# EAGLE design grbl-cnc3ax-nano (EAGLE 7.2.0)
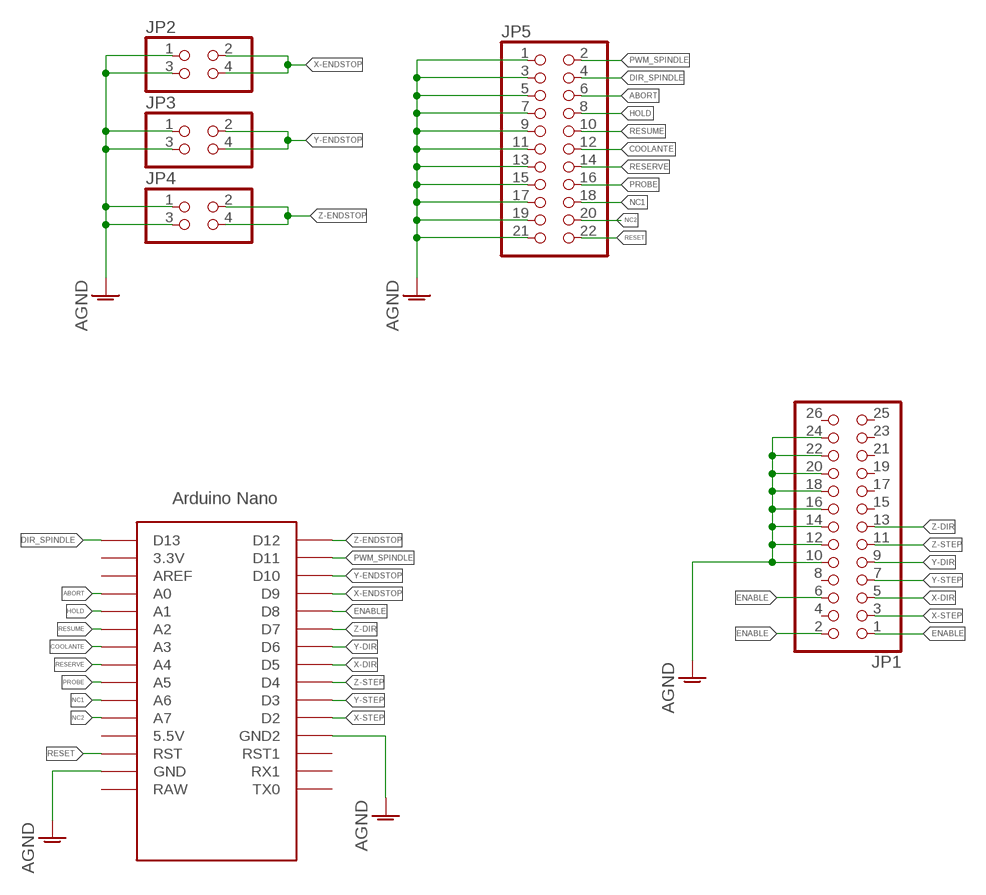
[diagram p0: schematic, sheet 1]

## Parts
JP1  PINHD-2X13  [2X13]
JP2  PINHD-2X2  [2X02]
JP3  PINHD-2X2  [2X02]
JP4  PINHD-2X2  [2X02]
JP5  PINHD-2X11  [2X11]
U$1  NANO  [NANO]

## Nets
ABORT: JP5.6 U$1.A0
AGND: JP1.10 JP1.12 JP1.14 JP1.16 JP1.18 JP1.20 JP1.22 JP1.24 JP2.1 JP2.3 JP3.1 JP3.3 JP4.1 JP4.3 JP5.1 JP5.3 JP5.5 JP5.7 JP5.9 JP5.11 JP5.13 JP5.15 JP5.17 JP5.19 JP5.21 U$1.GND U$1.GND1(GND2)
COOLANTE: JP5.12 U$1.A3
DIR_SPINDLE: JP5.4 U$1.D13
ENABLE: JP1.1 JP1.2 JP1.6 U$1.D8
HOLD: JP5.8 U$1.A1
NC1: JP5.18 U$1.A6
NC2: JP5.20 U$1.A7
PROBE: JP5.16 U$1.A5
PWM_SPINDLE: JP5.2 U$1.D11
RESERVE: JP5.14 U$1.A4
RESET: JP5.22 U$1.RST
RESUME: JP5.10 U$1.A2
X-DIR: JP1.5 U$1.D5
X-ENDSTOP: JP2.2 JP2.4 U$1.D9
X-STEP: JP1.3 U$1.D2
Y-DIR: JP1.9 U$1.D6
Y-ENDSTOP: JP3.2 JP3.4 U$1.D10
Y-STEP: JP1.7 U$1.D3
Z-DIR: JP1.13 U$1.D7
Z-ENDSTOP: JP4.2 JP4.4 U$1.D12
Z-STEP: JP1.11 U$1.D4
Unconnected: JP1.4 JP1.8 JP1.15 JP1.17 JP1.19 JP1.21 JP1.23 JP1.25 JP1.26 U$1.3.3V U$1.5V(5.5V) U$1.AREF U$1.ICSP1 U$1.ICSP2 U$1.ICSP3 U$1.ICSP4 U$1.ICSP5 U$1.ICSP6 U$1.RAW U$1.RST1 U$1.RX1 U$1.TX0

## Library data of the parts
JP1 = pinhead:PINHD-2X13: PIN HEADER
JP2-JP4 = pinhead:PINHD-2X2: PIN HEADER
JP5 = pinhead:PINHD-2X11: PIN HEADER
U$1 = Arduino-clone:NANO: Arduino Nano

## Board
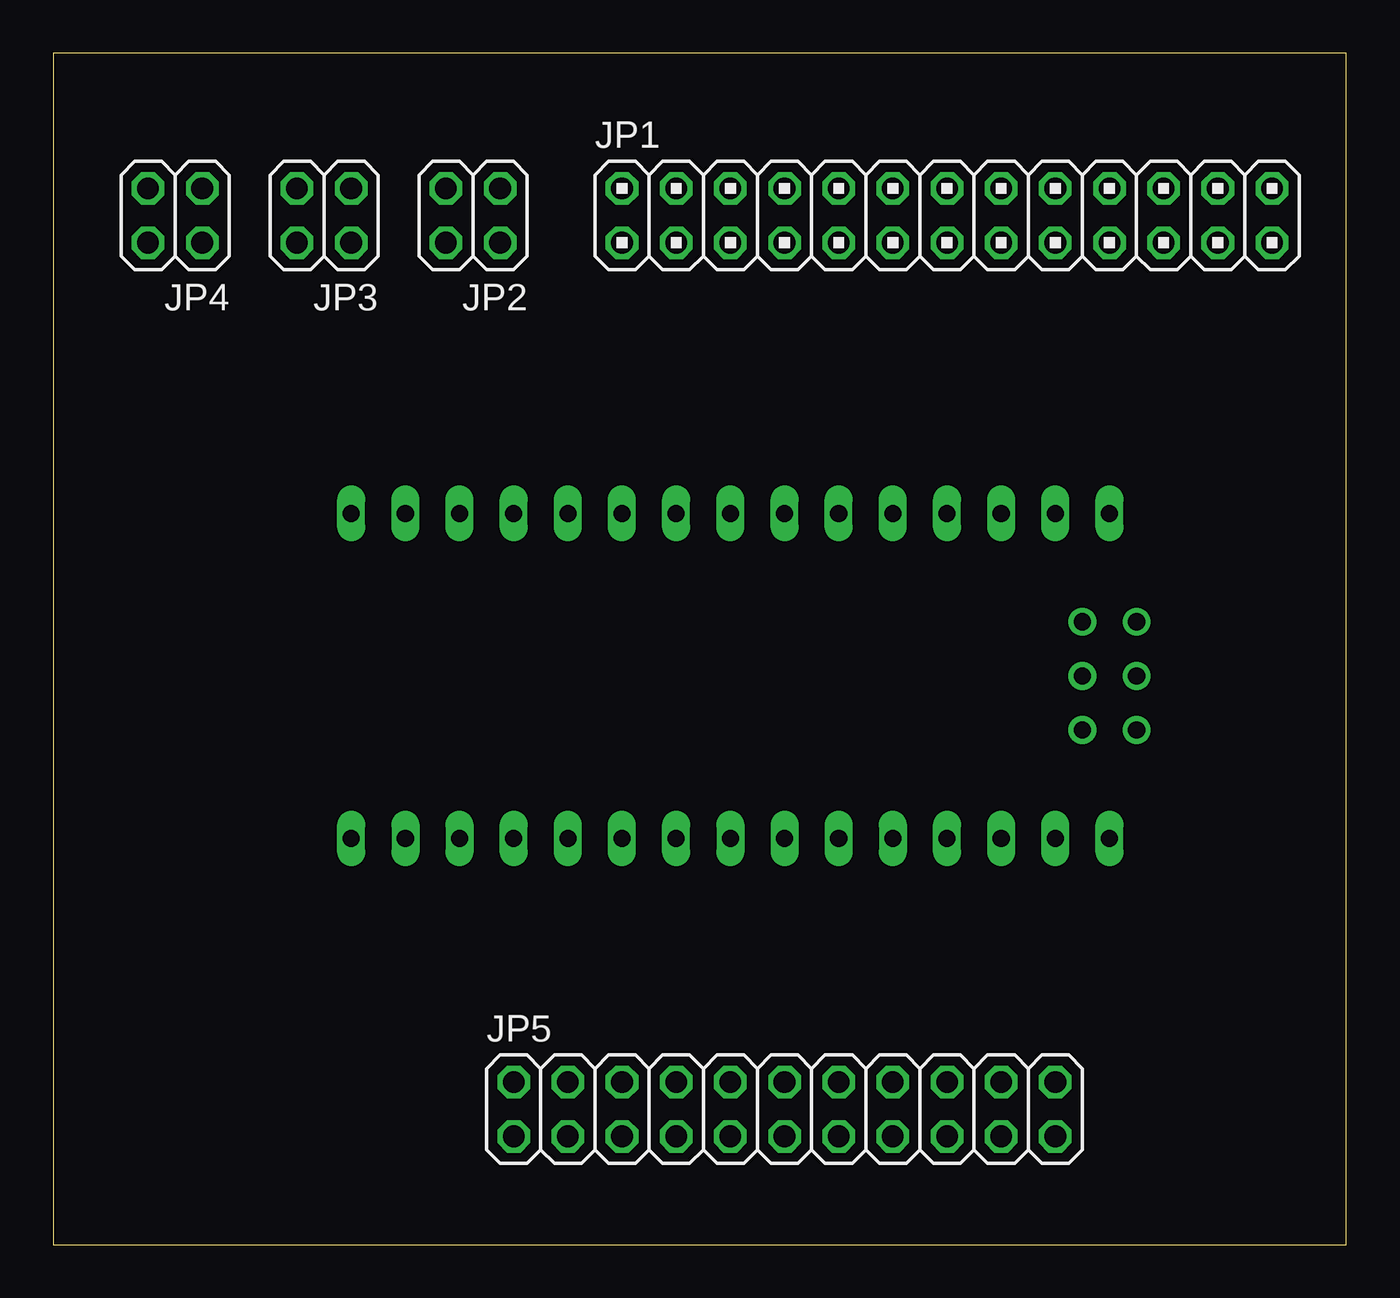
[diagram p1: board, top side]
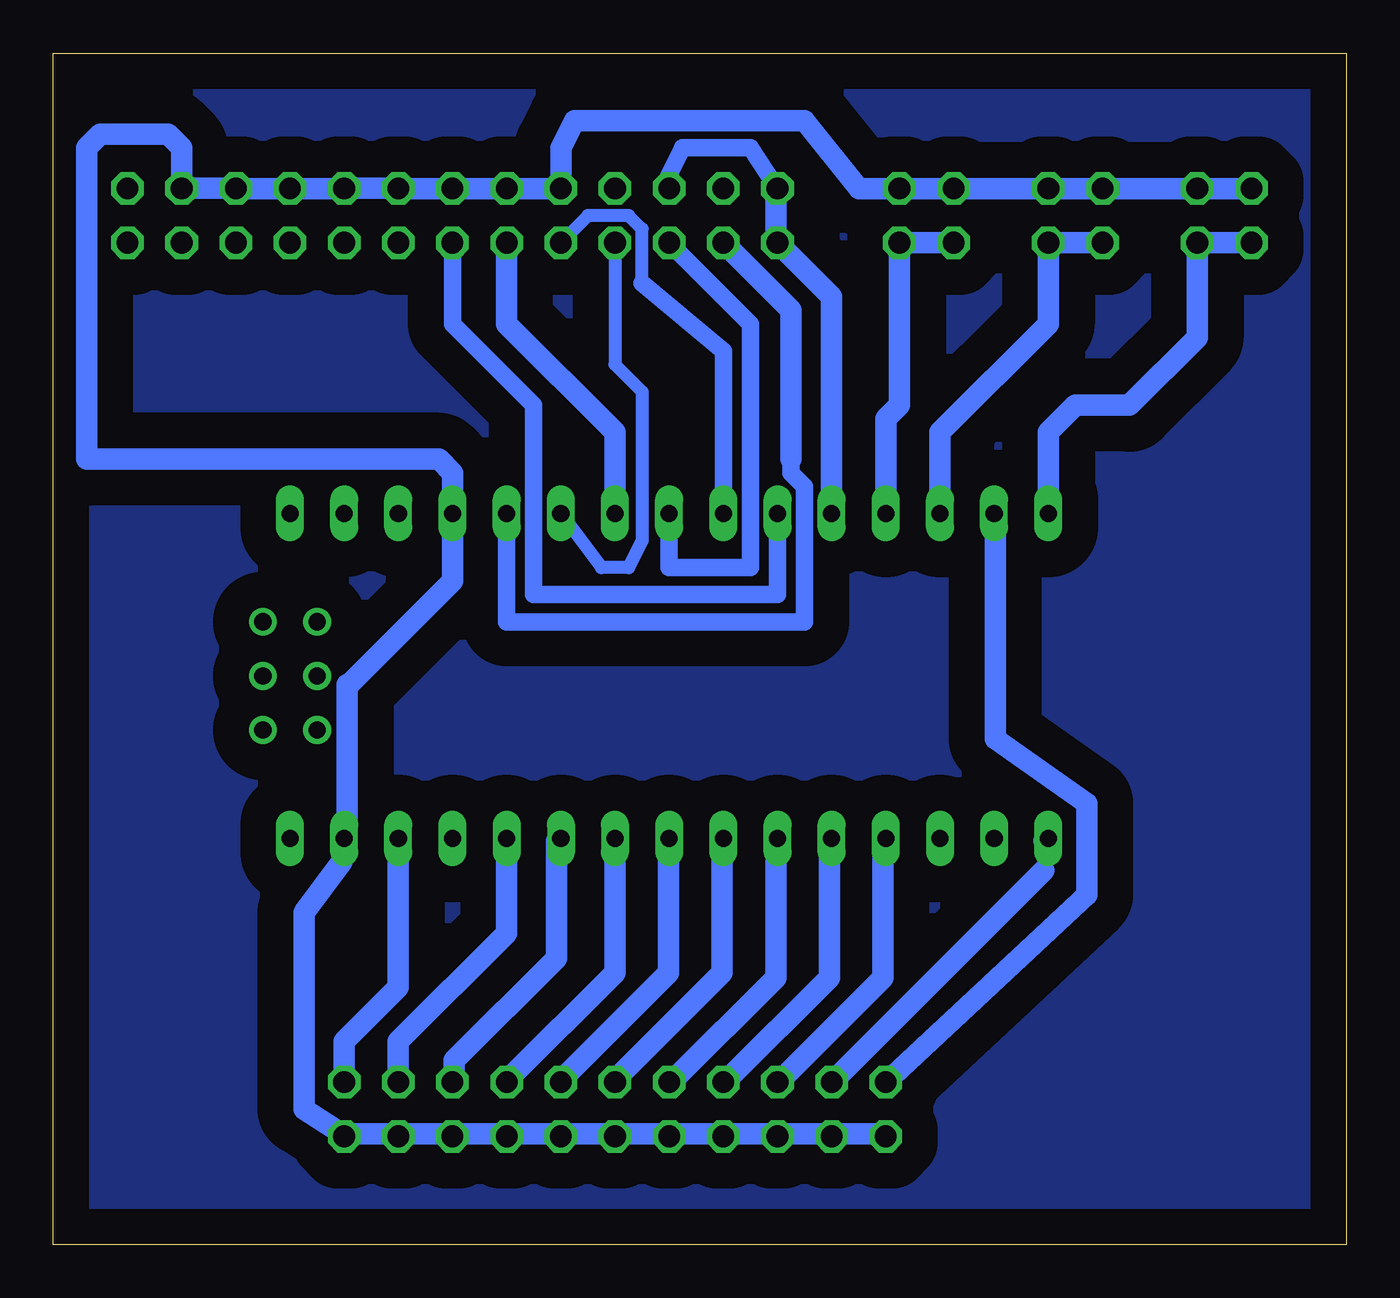
[diagram p2: board, bottom side, seen from below]

Size 60.63 x 55.87 mm. Coordinates in mm from the lower left corner, seen from the top.
Outline: 0,0 60.63,0 60.63,55.87 0,55.87 0,0
Copper layers (1*16): Top 0.035mm / dielectric 1.5mm / Bottom 0.035mm
Design rules "default": minimum track width 10mil, minimum drill 24mil, track to track 8mil, track to pad 8mil, pad to pad 8mil, via to via 8mil, smd to smd 8mil, copper to edge 40mil, drill to drill 8mil, minimum pad ring 10mil, minimum via ring 8mil, stop-mask expansion 4mil, vias tented up to drill 0mil, thermal gap 10mil

### Footprints (pad centres in the part's own frame; a part is rotated, then mirrored left to right if it is on the bottom)
2X13 = drill 1.016 octagon: 1 -15.24,-1.27; 2 -15.24,1.27; 3 -12.7,-1.27; 4 -12.7,1.27; 5 -10.16,-1.27; 6 -10.16,1.27; 7 -7.62,-1.27; 8 -7.62,1.27; 9 -5.08,-1.27; 10 -5.08,1.27; 11 -2.54,-1.27; 12 -2.54,1.27; 13 0,-1.27; 14 0,1.27; 15 2.54,-1.27; 16 2.54,1.27; 17 5.08,-1.27; 18 5.08,1.27; 19 7.62,-1.27; 20 7.62,1.27; 21 10.16,-1.27; 22 10.16,1.27; 23 12.7,-1.27; 24 12.7,1.27; 25 15.24,-1.27; 26 15.24,1.27
2X02 = drill 1.016 octagon: 1 -1.27,-1.27; 2 -1.27,1.27; 3 1.27,-1.27; 4 1.27,1.27
2X11 = drill 1.016 octagon: 1 -12.7,-1.27; 2 -12.7,1.27; 3 -10.16,-1.27; 4 -10.16,1.27; 5 -7.62,-1.27; 6 -7.62,1.27; 7 -5.08,-1.27; 8 -5.08,1.27; 9 -2.54,-1.27; 10 -2.54,1.27; 11 0,-1.27; 12 0,1.27; 13 2.54,-1.27; 14 2.54,1.27; 15 5.08,-1.27; 16 5.08,1.27; 17 7.62,-1.27; 18 7.62,1.27; 19 10.16,-1.27; 20 10.16,1.27; 21 12.7,-1.27; 22 12.7,1.27
NANO = drill 0.8 long: 3.3V -10.16,24.13; 5V -10.16,-1.27; A0 -10.16,19.05; A1 -10.16,16.51; A2 -10.16,13.97; A3 -10.16,11.43; A4 -10.16,8.89; A5 -10.16,6.35; A6 -10.16,3.81; A7 -10.16,1.27; AREF -10.16,21.59; D2 5.08,1.27; D3 5.08,3.81; D4 5.08,6.35; D5 5.08,8.89; D6 5.08,11.43; D7 5.08,13.97; D8 5.08,16.51; D9 5.08,19.05; D10 5.08,21.59; D11 5.08,24.13; D12 5.08,26.67; D13 -10.16,26.67; GND -10.16,-6.35; GND1 5.08,-1.27; RAW -10.16,-8.89; RST -10.16,-3.81; RST1 5.08,-3.81; RX1 5.08,-6.35; TX0 5.08,-8.89 | drill 0.8: ICSP1 -5.08,-10.16; ICSP2 -5.08,-7.62; ICSP3 -2.54,-10.16; ICSP4 -2.54,-7.62; ICSP5 0,-10.16; ICSP6 0,-7.62

### Placement (x,y rotation side)
JP1  41.91,48.26 0 top
JP2  19.68,48.26 180 top
JP3  12.7,48.26 180 top
JP4  5.71,48.26 180 top
JP5  34.29,6.35 0 top
U$1  40.64,29.21 90 top

### Tracks (layer width: path | path; a pad name or v marks a point on that pad's centre or on a via)
ABORT
  Bottom 0.254: 21.72,18.92 U$1.A0 | 26.52,7.72 JP5.6
  Bottom 1.016: 21.72,18.92 21.72,12.52 26.52,7.72
AGND
  Bottom 0.254: 24,5.21 JP5.3 24.23,5.21 | 26.75,5.21 JP5.5 26.52,5.21 | 29.03,5.21 JP5.7 29.26,5.21 | 31.55,5.21 JP5.9 31.77,5.21 | 37.03,5.21 JP5.13 36.8,5.21 | 39.32,5.21 JP5.15 39.55,5.21 | 42.06,5.21 JP5.17 41.83,5.21 | 44.35,5.21 JP5.19 44.58,5.21 | 47.09,18.92 U$1.GND 46.86,19.15 | 47.09,5.21 JP5.21 46.86,5.21 | 34.29,5.21 JP5.11 | 52.12,49.55 JP1.22 | 54.41,49.55 JP1.24 | 46.86,49.55 JP1.18 | 44.58,49.55 JP1.16
  Bottom 1.016: 24,5.21 21.72,5.21 JP5.1 | 29.03,5.21 26.75,5.21 | 29.26,5.21 31.55,5.21 | 31.77,5.21 34.29,5.21 36.8,5.21 | 26.52,5.21 24.23,5.21 | 39.32,5.21 37.03,5.21 | 44.35,5.21 42.06,5.21 | 41.83,5.21 39.55,5.21 | 47.09,18.92 47.09,17.98 48.87,15.57 48.87,6.35 47.09,5.21 | 46.86,5.21 44.58,5.21 | 46.86,19.15 46.86,26.26 46.76,26.26 41.91,31.12 U$1.GND1 41.91,36.2 42.55,36.83 59.05,36.83 59.05,51.44 58.42,52.07 55.24,52.07 54.61,51.44 JP1.24 | 54.41,49.55 52.09,49.55 JP1.22 JP1.20 JP1.18 | 46.86,49.55 44.48,49.55 JP1.16 JP1.14 JP1.12 JP1.10 36.83,51.44 36.2,52.7 25.4,52.7 22.86,49.53 JP2.1 JP2.3 JP3.1 JP3.3 JP4.1 JP4.3
COOLANTE
  Bottom 0.254: 29.26,18.92 U$1.A3 | 34.29,7.72 JP5.12
  Bottom 1.016: 29.26,18.92 29.26,12.75 34.29,7.72
DIR_SPINDLE
  Bottom 0.254: 14.17,17.55 14.17,18.92 | 24,7.72 JP5.4
  Bottom 1.016: 24,7.72 14.17,17.55 | 14.17,18.92 U$1.D13
ENABLE
  Bottom 0.254: 26.75,49.33 JP1.2 | 26.75,47.04 JP1.1 | 31.55,49.33 JP1.6
  Bottom 0.813: 26.75,49.33 26.75,49.61 27.94,51.44 31.11,51.44 31.75,50.16 JP1.6
  Bottom 1.016: U$1.D8 24.13,44.45 JP1.1 | 26.75,47.04 26.75,49.33 26.75,49.45 JP1.2
HOLD
  Bottom 0.254: 24.23,18.92 U$1.A1 | 29.03,7.72 JP5.8
  Bottom 1.016: 24.23,18.92 24.23,12.52 29.03,7.72
N$1
  pour Bottom (isolate 1.676): 0.64,55.25 0.64,0.63 60.33,0.63 60.33,55.25
NC1
  Bottom 0.254: 37.03,18.92 U$1.A6 | 41.83,7.72 JP5.18
  Bottom 1.016: 37.03,18.92 37.03,13.44 41.83,8.64 41.83,7.72
NC2
  Bottom 1.016: U$1.A7 39.37,14.6 44.45,9.53 JP5.20
PROBE
  Bottom 1.016: U$1.A5 34.29,12.75 39.32,7.72 JP5.16
PWM_SPINDLE
  Bottom 0.254: 16.46,34.24 U$1.D11
  Bottom 1.016: 16.46,34.24 16.46,23.72 12.17,20.7 12.17,16.41 JP5.2
RESERVE
  Bottom 0.254: 31.77,18.92 U$1.A4 | 36.8,7.72 JP5.14
  Bottom 1.016: 31.77,18.92 31.77,12.75 36.8,7.72
RESET
  Bottom 1.016: U$1.RST 44.45,12.06 46.99,9.53 JP5.22
RESUME
  Bottom 0.254: 26.75,18.92 U$1.A2
  Bottom 1.016: 26.75,18.92 26.75,12.52 31.55,7.72 JP5.10
X-DIR
  Bottom 0.813: U$1.D5 31.75,31.75 27.94,31.75 27.94,43.18 JP1.5
X-ENDSTOP
  Bottom 1.016: JP2.4 JP2.2 20.95,39.37 21.59,38.73 U$1.D9
X-STEP
  Bottom 0.813: 26.04,36.83 26.04,36.2 25.4,35.56 25.4,29.21 39.37,29.21 U$1.D2
  Bottom 1.016: JP1.3 26.04,43.82 26.04,36.83
Y-DIR
  Bottom 0.61: 33.02,45.09 33.02,47.62 33.66,48.26 35.56,48.26 JP1.9
  Bottom 0.813: U$1.D6 29.21,41.91 33.02,45.09
Y-ENDSTOP
  Bottom 1.016: JP3.4 JP3.2 13.97,43.18 19.05,38.1 U$1.D10
Y-STEP
  Bottom 0.61: JP1.7 34.29,41.27 33.02,40.01 33.02,33.02 33.66,31.75 34.92,31.75 U$1.D3
Z-DIR
  Bottom 0.813: U$1.D7 26.67,30.48 38.1,30.48 38.1,39.37 41.91,43.18 JP1.13
Z-ENDSTOP
  Bottom 1.016: JP4.4 JP4.2 6.99,42.55 10.16,39.37 12.7,39.37 13.97,38.1 U$1.D12
Z-STEP
  Bottom 1.016: U$1.D4 34.29,38.1 39.37,43.18 JP1.11